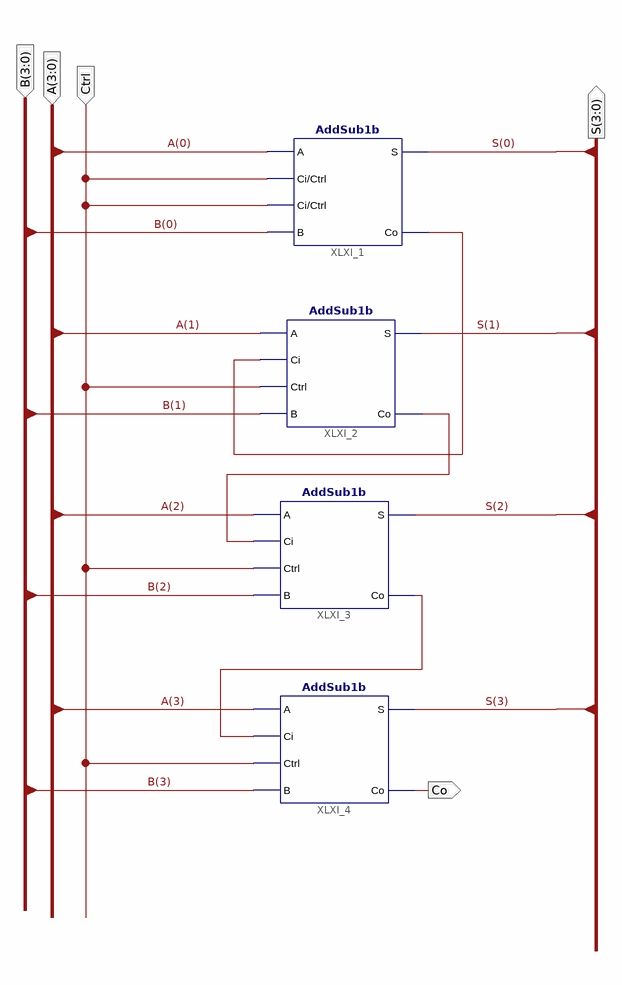
[diagram p0: schematic sheet 1]
// Xilinx ISE schematic AddSub4b_copy.sch (kintex7) as structural Verilog: 4 symbols, 5 ports
module AddSub4b_copy (
  input  [3:0] B,
  input  Ctrl,
  input  [3:0] A,
  output Co,
  output [3:0] S
);

  wire XLXN_13, XLXN_14, XLXN_16;

  AddSub1b XLXI_1 (.A(A[0]), .Ci(Ctrl), .Ctrl(Ctrl), .B(B[0]), .S(S[0]), .Co(XLXN_13));
  AddSub1b XLXI_2 (.A(A[1]), .Ci(XLXN_13), .Ctrl(Ctrl), .B(B[1]), .S(S[1]), .Co(XLXN_14));
  AddSub1b XLXI_3 (.A(A[2]), .Ci(XLXN_14), .Ctrl(Ctrl), .B(B[2]), .S(S[2]), .Co(XLXN_16));
  AddSub1b XLXI_4 (.A(A[3]), .Ci(XLXN_16), .Ctrl(Ctrl), .B(B[3]), .S(S[3]), .Co(Co));
endmodule
